# EAGLE schematic mainboard (EAGLE 9.6.2)
c't-Bot Hauptplatine v2; CC BY-SA 4.0, Timo Sandmann

## Sheet 1 of 2
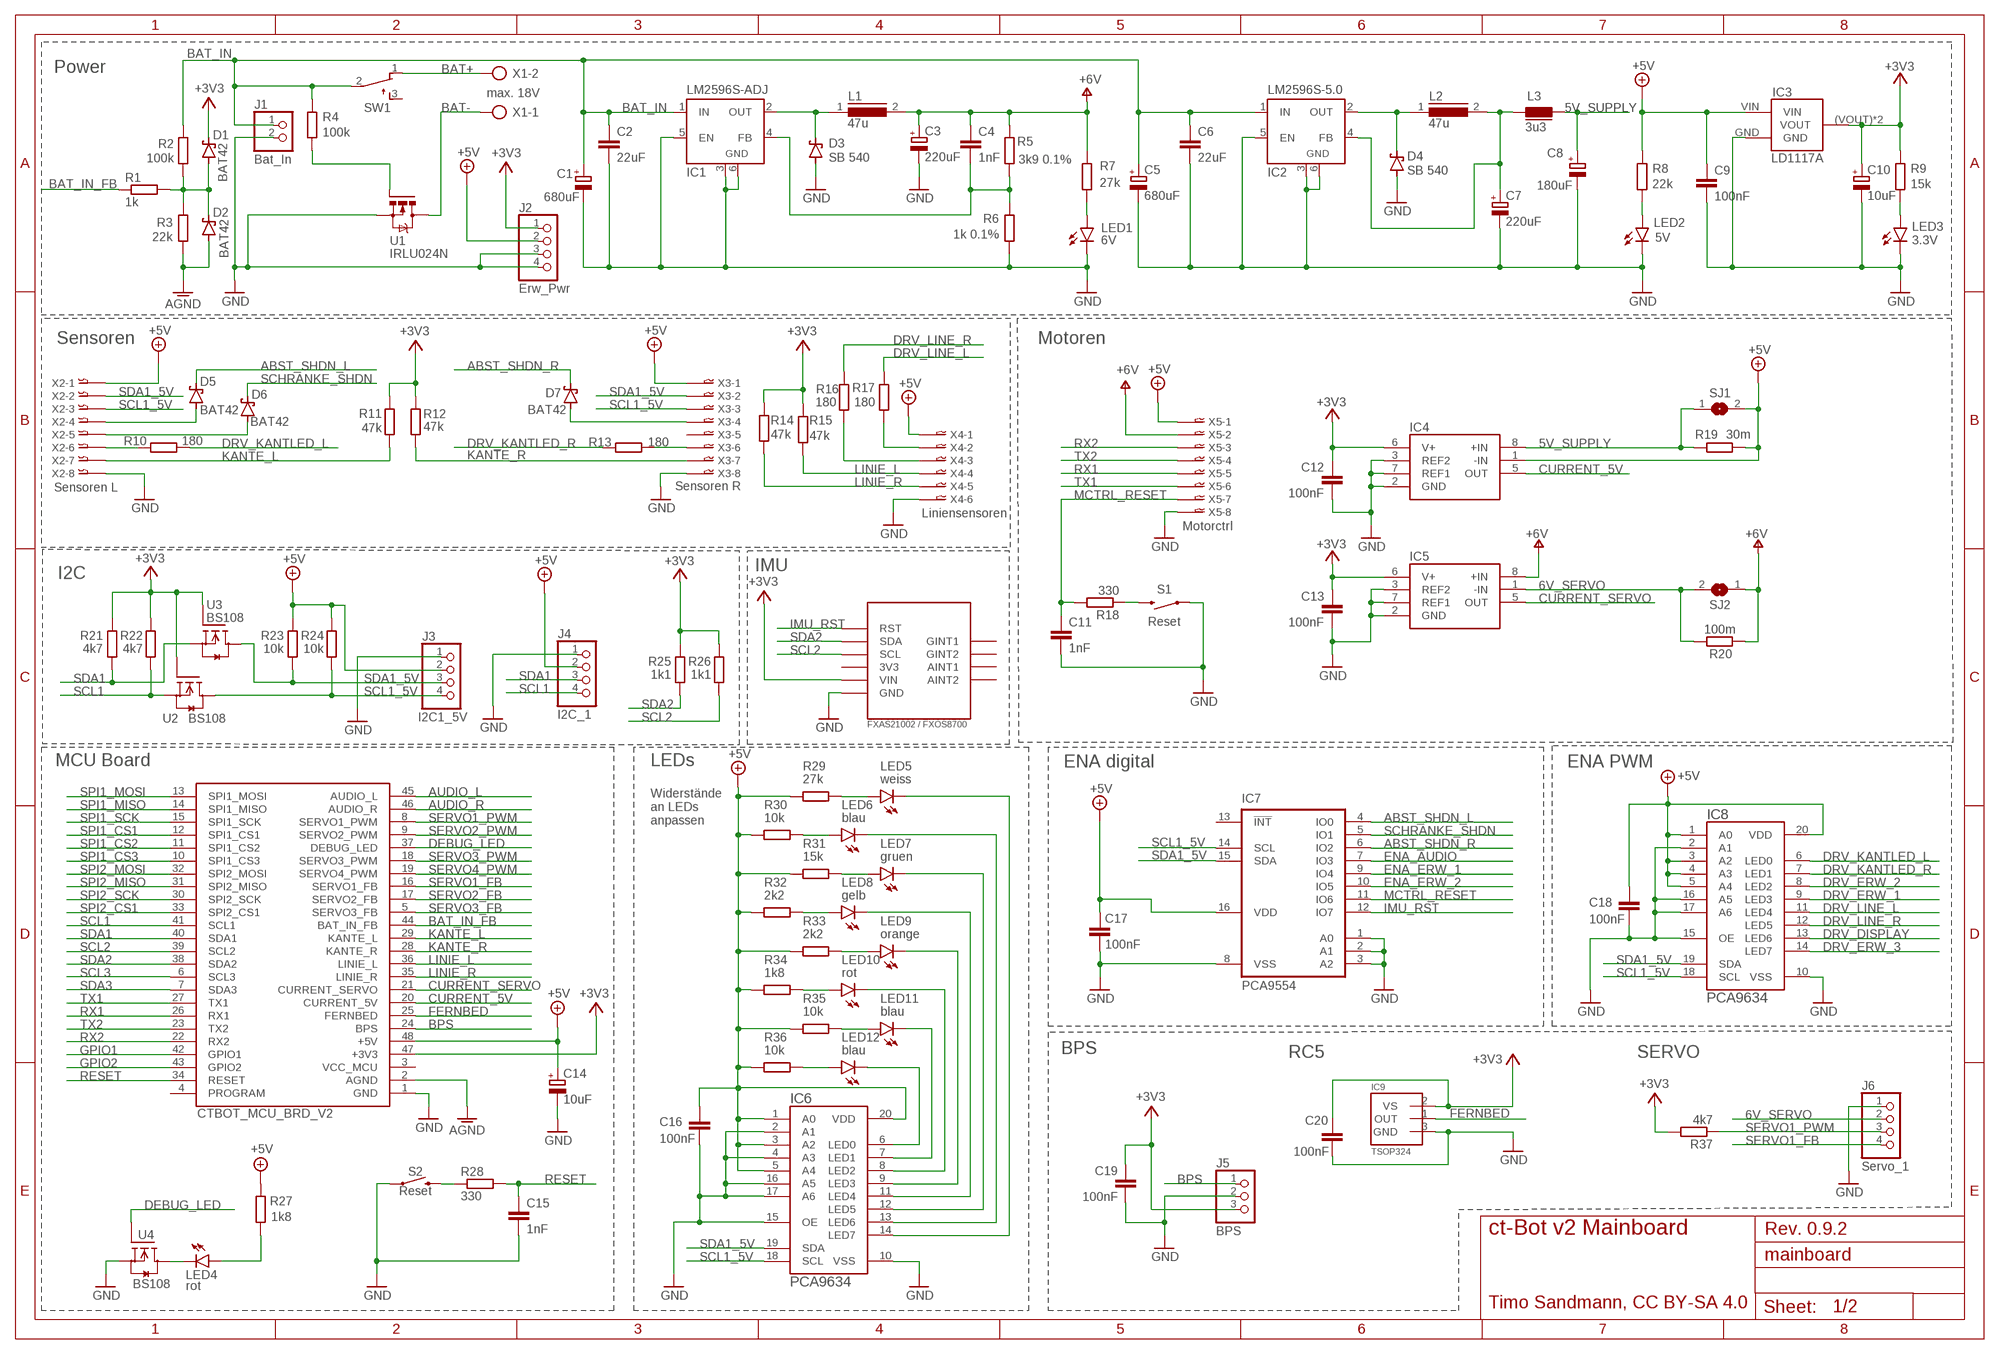
[diagram p0: schematic, sheet 1]

### Parts
C1  680uF  CPOL-EUE5-10.5  [E5-10,5]
C2  22uF  C-EU025-025X050  [C025-025X050]
C3  220uF  CPOL-EUE5-10.5  [E5-10,5]
C4  1nF  C-EU025-025X050  [C025-025X050]
C5  680uF  CPOL-EUE5-10.5  [E5-10,5]
C6  22uF  C-EU025-025X050  [C025-025X050]
C7  220uF  CPOL-EUE5-10.5  [E5-10,5]
C8  180uF  CPOL-EUE3.5-8  [E3,5-8]
C9  100nF  C-EU025-025X050  [C025-025X050]
C10  10uF  CPOL-EUE2-5  [E2-5]
C11  1nF  C-EU025-025X050  [C025-025X050]
C12  100nF  C-EUC0805  [C0805]
C13  100nF  C-EUC0805  [C0805]
C14  10uF  CPOL-EUTT2D5L  [TT2D5L]
C15  1nF  C-EU025-025X050  [C025-025X050]
C16  100nF  C-EU025-025X050  [C025-025X050]
C17  100nF  C-EU025-025X050  [C025-025X050]
C18  100nF  C-EU025-025X050  [C025-025X050]
C19  100nF  C-EU025-025X050  [C025-025X050]
C20  100nF  C-EU025-025X050  [C025-025X050]
D1  BAT42  BAT42DO35-7  [DO35-7]
D2  BAT42  BAT42DO35-7  [DO35-7]
D3  SB 540  SCHOTTKY-DIODEDO201T15  [DO201T15]
D4  SB 540  SCHOTTKY-DIODEDO201T15  [DO201T15]
D5  BAT42  BAT42"  [0207/2V]
D6  BAT42  BAT42"  [0207/2V]
D7  BAT42  BAT42"  [0207/2V]
IC1  LM2596S-ADJ  LM2596S  [TO263-5]
IC2  LM2596S-5.0  LM2596S  [TO263-5]
IC3  LD1117A  LD1117  [LD1117SOT-223]
IC4  INA28AID  [SO08]
IC5  INA28AID  [SO08]
IC6  PCA9634  PCA9634-SO20  [SO20W]
IC7  PCA9554  PCA9554D  [SO16W]
IC8  PCA9634  PCA9634-SO20  [SO20W]
IC9  TSOP324  [TSOP324]
J1  Bat_In  PINHD-1X2  [1X02]
J2  Erw_Pwr  PINHD-1X4  [1X04]
J3  I2C1_5V  PINHD-1X4  [1X04]
J4  I2C_1  PINHD-1X4  [1X04]
J5  BPS  PINHD-1X3  [1X03]
J6  Servo_1  PINHD-1X4  [1X04]
L1  47u  INDUCTOR_09HCP  [09HCP]
L2  47u  INDUCTOR_09HCP  [09HCP]
L3  3u3  07HCP-3U3  [FASTRON_07HCP_INDUCTOR]
LED1  6V  LED3MM  [LED3MM]
LED2  5V  LED3MM  [LED3MM]
LED3  3.3V  LED3MM  [LED3MM]
LED4  rot  LED3MM  [LED3MM]
LED5  weiss  LED3MM  [LED3MM]
LED6  blau  LED3MM  [LED3MM]
LED7  gruen  LED3MM  [LED3MM]
LED8  gelb  LED3MM  [LED3MM]
LED9  orange  LED3MM  [LED3MM]
LED10  rot  LED3MM  [LED3MM]
LED11  blau  LED3MM  [LED3MM]
LED12  blau  LED3MM  [LED3MM]
MCU  CTBOT_MCU_BRD_V2  [DIP48]
R1  1k  R-EU_0204/7  [0204/7]
R2  100k  R-EU_0204/7  [0204/7]
R3  22k  R-EU_0204/7  [0204/7]
R4  100k  R-EU_0204/2V  [0204V]
R5  3k9 0.1%  R-EU_0204/2V  [0204V]
R6  1k 0.1%  R-EU_0204/2V  [0204V]
R7  27k  R-EU_0204/2V  [0204V]
R8  22k  R-EU_0204/2V  [0204V]
R9  15k  R-EU_0204/2V  [0204V]
R10  180  R-EU_0204/2V  [0204V]
R11  47k  R-EU_0204/2V  [0204V]
R12  47k  R-EU_0204/2V  [0204V]
R13  180  R-EU_0204/2V  [0204V]
R14  47k  R-EU_0204/7  [0204/7]
R15  47k  R-EU_0204/7  [0204/7]
R16  180  R-EU_0204/2V  [0204V]
R17  180  R-EU_0204/2V  [0204V]
R18  330  R-EU_0204/2V  [0204V]
R19  30m  R-EU_R2512  [R2512]
R20  100m  R-EU_R2512  [R2512]
R21  4k7  R-EU_0204/7  [0204/7]
R22  4k7  R-EU_0204/7  [0204/7]
R23  10k  R-EU_0204/2V  [0204V]
R24  10k  R-EU_0204/2V  [0204V]
R25  1k1  R-EU_0204/7  [0204/7]
R26  1k1  R-EU_0204/7  [0204/7]
R27  1k8  R-EU_0204/2V  [0204V]
R28  330  R-EU_0204/2V  [0204V]
R29  27k  R-EU_0204/2V  [0204V]
R30  10k  R-EU_0204/2V  [0204V]
R31  15k  R-EU_0204/2V  [0204V]
R32  2k2  R-EU_0204/2V  [0204V]
R33  2k2  R-EU_0204/2V  [0204V]
R34  1k8  R-EU_0204/2V  [0204V]
R35  10k  R-EU_0204/2V  [0204V]
R36  10k  R-EU_0204/2V  [0204V]
R37  4k7  R-EU_0204/7  [0204/7]
S1  Reset  MOMENTARY-SWITCH-SPST-PTH-6.0MM  [TACTILE_SWITCH_PTH_6.0MM]
S2  Reset  MOMENTARY-SWITCH-SPST-PTH-6.0MM  [TACTILE_SWITCH_PTH_6.0MM]
SJ1  SJ  [SJ]
SJ2  SJ  [SJ]
SW1  TL32PO  [TL3XPO]
U1  IRLU024N  IRLU024NTO-251AA  [TO251AA]
U2  BS108  [SOT54E]
U3  BS108  [SOT54E]
U4  BS108  [SOT54E]
U$10  IMU  NXP_9DOF  [NXP_9DOF]
X1  max. 18V  SCHRAUBKLEMME/2  [AK500/2-H]
X2  Sensoren L  08-JST  [B8B-XH]
X3  Sensoren R  08-JST  [B8B-XH]
X4  Liniensensoren  06-JST-B6B-XH-A  [B6B-XH]
X5  Motorctrl  08-JST  [B8B-XH]

### Nets
5V_SUPPLY: C8.+ IC4.8(+IN) L3.2 R19.1 SJ1.1
6V_SERVO [high_current]: IC5.1(-IN) J6.2 R20.2 SJ2.2 ; also sheet 2
+3V3 [power]: C10.+ C12.1 C13.1 C19.1 C20.1 D1.C IC3.(VOUT)(VOUT) IC3.VOUT IC4.6(V+) IC5.6(V+) IC9.2(VS) J2.1 J5.3 MCU.47(+3V3) R9.2 R11.2 R12.1 R14.2 R15.2 R21.2 R22.2 R25.2 R26.2 R37.2 U2.G U3.G U$10.VIN ; also sheet 2
+5V [power]: C9.1 C14.+ C16.1 C17.1 C18.1 IC3.VIN IC4.1(-IN) IC6.1(A0) IC6.3(A2) IC6.5(A4) IC6.20(VDD) IC7.16(VDD) IC8.1(A0) IC8.3(A2) IC8.4(A3) IC8.5(A4) IC8.20(VDD) J2.2 J3.2 J4.2 MCU.48(+5V) R8.2 R19.2 R23.2 R24.2 R27.2 R29.1 R30.1 R31.1 R32.1 R33.1 R34.1 R35.1 R36.1 SJ1.2 X2.P$1 X3.P$1 X4.P$1 X5.P$1 ; also sheet 2
+6V [high_current]: C3.+ C4.1 IC5.8(+IN) L1.2 R5.2 R7.1 R20.1 SJ2.1 X5.P$2
ABST_SHDN_L: D5.2(C) IC7.4(IO0)
ABST_SHDN_R: D7.2(C) IC7.6(IO2)
AGND [power]: D2.A MCU.2(AGND) R3.1 ; also sheet 2
AUDIO_L: MCU.45(AUDIO_L) ; also sheet 2
AUDIO_R: MCU.46(AUDIO_R) ; also sheet 2
BAT+ [high_current]: SW1.1(O) X1.2
BAT- [high_current]: U1.2(D) U1.4(D) X1.1
BAT_IN [high_current]: C1.+ C2.1 C5.+ C6.1 IC1.1(IN) IC2.1(IN) J1.1 R2.2 R4.2 SW1.2(P) ; also sheet 2
BAT_IN_FB: MCU.44(BAT_IN_FB) R1.1
BPS: J5.1 MCU.24(BPS)
CURRENT_5V: IC4.5(OUT) MCU.20(CURRENT_5V)
CURRENT_SERVO: IC5.5(OUT) MCU.21(CURRENT_SERVO)
DEBUG_LED: MCU.37(DEBUG_LED) U4.G
DRV_DISPLAY: IC8.13(LED6) ; also sheet 2
DRV_ERW_1: IC8.9(LED3) ; also sheet 2
DRV_ERW_2: IC8.8(LED2) ; also sheet 2
DRV_ERW_3: IC8.14(LED7) ; also sheet 2
DRV_KANTLED_L: IC8.6(LED0) R10.2
DRV_KANTLED_R: IC8.7(LED1) R13.1
DRV_LINE_L: IC8.11(LED4) R17.2
DRV_LINE_R: IC8.12(LED5) R16.2
ENA_AUDIO: IC7.7(IO3) ; also sheet 2
ENA_ERW_1: IC7.9(IO4) ; also sheet 2
ENA_ERW_2: IC7.10(IO5) ; also sheet 2
FERNBED: IC9.1(OUT) MCU.25(FERNBED)
GND [power]: C1.- C2.2 C3.- C5.- C6.2 C7.- C8.- C9.2 C10.- C11.2 C12.2 C13.2 C14.- C15.2 C16.2 C17.2 C18.2 C19.2 C20.2 D3.A D4.A IC1.3(GND) IC1.5(EN) IC1.6(GND) IC2.3(GND) IC2.5(EN) IC2.6(GND) IC3.GND IC4.2(GND) IC4.3(REF2) IC4.7(REF1) IC5.2(GND) IC5.3(REF2) IC5.7(REF1) IC6.2(A1) IC6.4(A3) IC6.10(VSS) IC6.15(OE) IC6.16(A5) IC6.17(A6) IC7.1(A0) IC7.2(A1) IC7.3(A2) IC7.8(VSS) IC8.2(A1) IC8.10(VSS) IC8.15(OE) IC8.16(A5) IC8.17(A6) IC9.3(GND) J1.2 J2.3 J2.4 J3.1 J4.1 J5.2 J6.1 LED1.K(C) LED2.K(C) LED3.K(C) MCU.1(GND) R6.1 S1.1 S2.1 U1.3(S) U4.S U$10.GND X2.P$8 X3.P$8 X4.P$6 X5.P$8 ; also sheet 2
GPIO1: MCU.42(GPIO1) ; also sheet 2
GPIO2: MCU.43(GPIO2) ; also sheet 2
IMU_RST: IC7.12(IO7) U$10.RST ; also sheet 2
KANTE_L: MCU.29(KANTE_L) R11.1 X2.P$7
KANTE_R: MCU.28(KANTE_R) R12.2 X3.P$7
LINIE_L: MCU.36(LINIE_L) R15.1 X4.P$4
LINIE_R: MCU.35(LINIE_R) R14.1 X4.P$5
MCTRL_RESET: C11.1 IC7.11(IO6) R18.2 X5.P$7
N$1: R16.1 X4.P$3
N$2: LED3.A R9.1
N$4: D1.A D2.C R1.2 R2.1 R3.2
N$5: R18.1 S1.3
N$6: IC6.6(LED0) LED12.K(C)
N$7: IC6.7(LED1) LED11.K(C)
N$8 [power]: LED1.A R7.2
N$9: C4.2 IC1.4(FB) R5.1 R6.2
N$11: LED2.A R8.1
N$13: IC6.8(LED2) LED10.K(C)
N$14: R28.1 S2.3
N$15: IC6.9(LED3) LED9.K(C)
N$16: IC6.11(LED4) LED8.K(C)
N$17: IC6.12(LED5) LED7.K(C)
N$18: IC6.13(LED6) LED6.K(C)
N$19: IC6.14(LED7) LED5.K(C)
N$20: LED5.A R29.2
N$21: LED6.A R30.2
N$22: LED7.A R31.2
N$23: LED8.A R32.2
N$24: LED9.A R33.2
N$25: LED10.A R34.2
N$26: LED11.A R35.2
N$27: LED12.A R36.2
N$28: LED4.A R27.1
N$29: LED4.K(C) U4.D
N$30: R17.1 X4.P$2
N$38: R4.1 U1.1(G)
N$51: R10.1 X2.P$6
N$53: R13.2 X3.P$6
RESET: C15.1 MCU.34(RESET) R28.2
RX1: MCU.26(RX1) X5.P$5 ; also sheet 2
RX2: MCU.22(RX2) X5.P$3
SCHRANKE_SHDN: D6.2(C) IC7.5(IO1)
SCL1: J4.4 MCU.41(SCL1) R22.1 U2.S
SCL1_5V: IC6.18(SCL) IC7.14(SCL) IC8.18(SCL) J3.4 R24.1 U2.D X2.P$3 X3.P$3
SCL2: MCU.39(SCL2) R26.1 U$10.SCL ; also sheet 2
SCL3: MCU.6(SCL3) ; also sheet 2
SDA1: J4.3 MCU.40(SDA1) R21.1 U3.S
SDA1_5V: IC6.19(SDA) IC7.15(SDA) IC8.19(SDA) J3.3 R23.1 U3.D X2.P$2 X3.P$2
SDA2: MCU.38(SDA2) R25.1 U$10.SDA ; also sheet 2
SDA3: MCU.7(SDA3) ; also sheet 2
SERVO1_FB: J6.4 MCU.16(SERVO1_FB)
SERVO1_PWM: J6.3 MCU.8(SERVO1_PWM) R37.1
SERVO2_FB: MCU.17(SERVO2_FB) ; also sheet 2
SERVO2_PWM: MCU.9(SERVO2_PWM) ; also sheet 2
SERVO3_FB: MCU.5(SERVO3_FB) ; also sheet 2
SERVO3_PWM: MCU.18(SERVO3_PWM) ; also sheet 2
SERVO4_PWM: MCU.19(SERVO4_PWM) ; also sheet 2
SPI1_CS1: MCU.12(SPI1_CS1) ; also sheet 2
SPI1_CS2: MCU.11(SPI1_CS2) ; also sheet 2
SPI1_CS3: MCU.10(SPI1_CS3) ; also sheet 2
SPI1_MISO: MCU.14(SPI1_MISO) ; also sheet 2
SPI1_MOSI: MCU.13(SPI1_MOSI) ; also sheet 2
SPI1_SCK: MCU.15(SPI1_SCK) ; also sheet 2
SPI2_CS1: MCU.33(SPI2_CS1) ; also sheet 2
SPI2_MISO: MCU.31(SPI2_MISO) ; also sheet 2
SPI2_MOSI: MCU.32(SPI2_MOSI) ; also sheet 2
SPI2_SCK: MCU.30(SPI2_SCK) ; also sheet 2
TX1: MCU.27(TX1) X5.P$6 ; also sheet 2
TX2: MCU.23(TX2) X5.P$4
V5_L2 [high_current]: D4.C IC2.2(OUT) L2.1
V5_L3 [power]: C7.+ IC2.4(FB) L2.2 L3.1
V6_L1 [high_current]: D3.C IC1.2(OUT) L1.1
VL53L0X_SHUT_L: D5.1(A) X2.P$4
VL53L0X_SHUT_R: D7.1(A) X3.P$4
VL6180X_SHDN: D6.1(A) X2.P$5
Unconnected: IC7.13(!INT) MCU.4(PROGRAM) SW1.3(S) U$10.3V3 U$10.AINT1 U$10.AINT2 U$10.GINT1 U$10.GINT2 X3.P$5

### Notes on the sheet
- Power
- Sensoren | Motoren
- IMU
- I2C
- MCU Board | LEDs | ENA digital | ENA PWM
- Widerstände
  an LEDs
  anpassen
- BPS | RC5 | SERVO
- Rev. 0.9.2
- ct-Bot v2 Mainboard
- Timo Sandmann, CC BY-SA 4.0

## Sheet 2 of 2
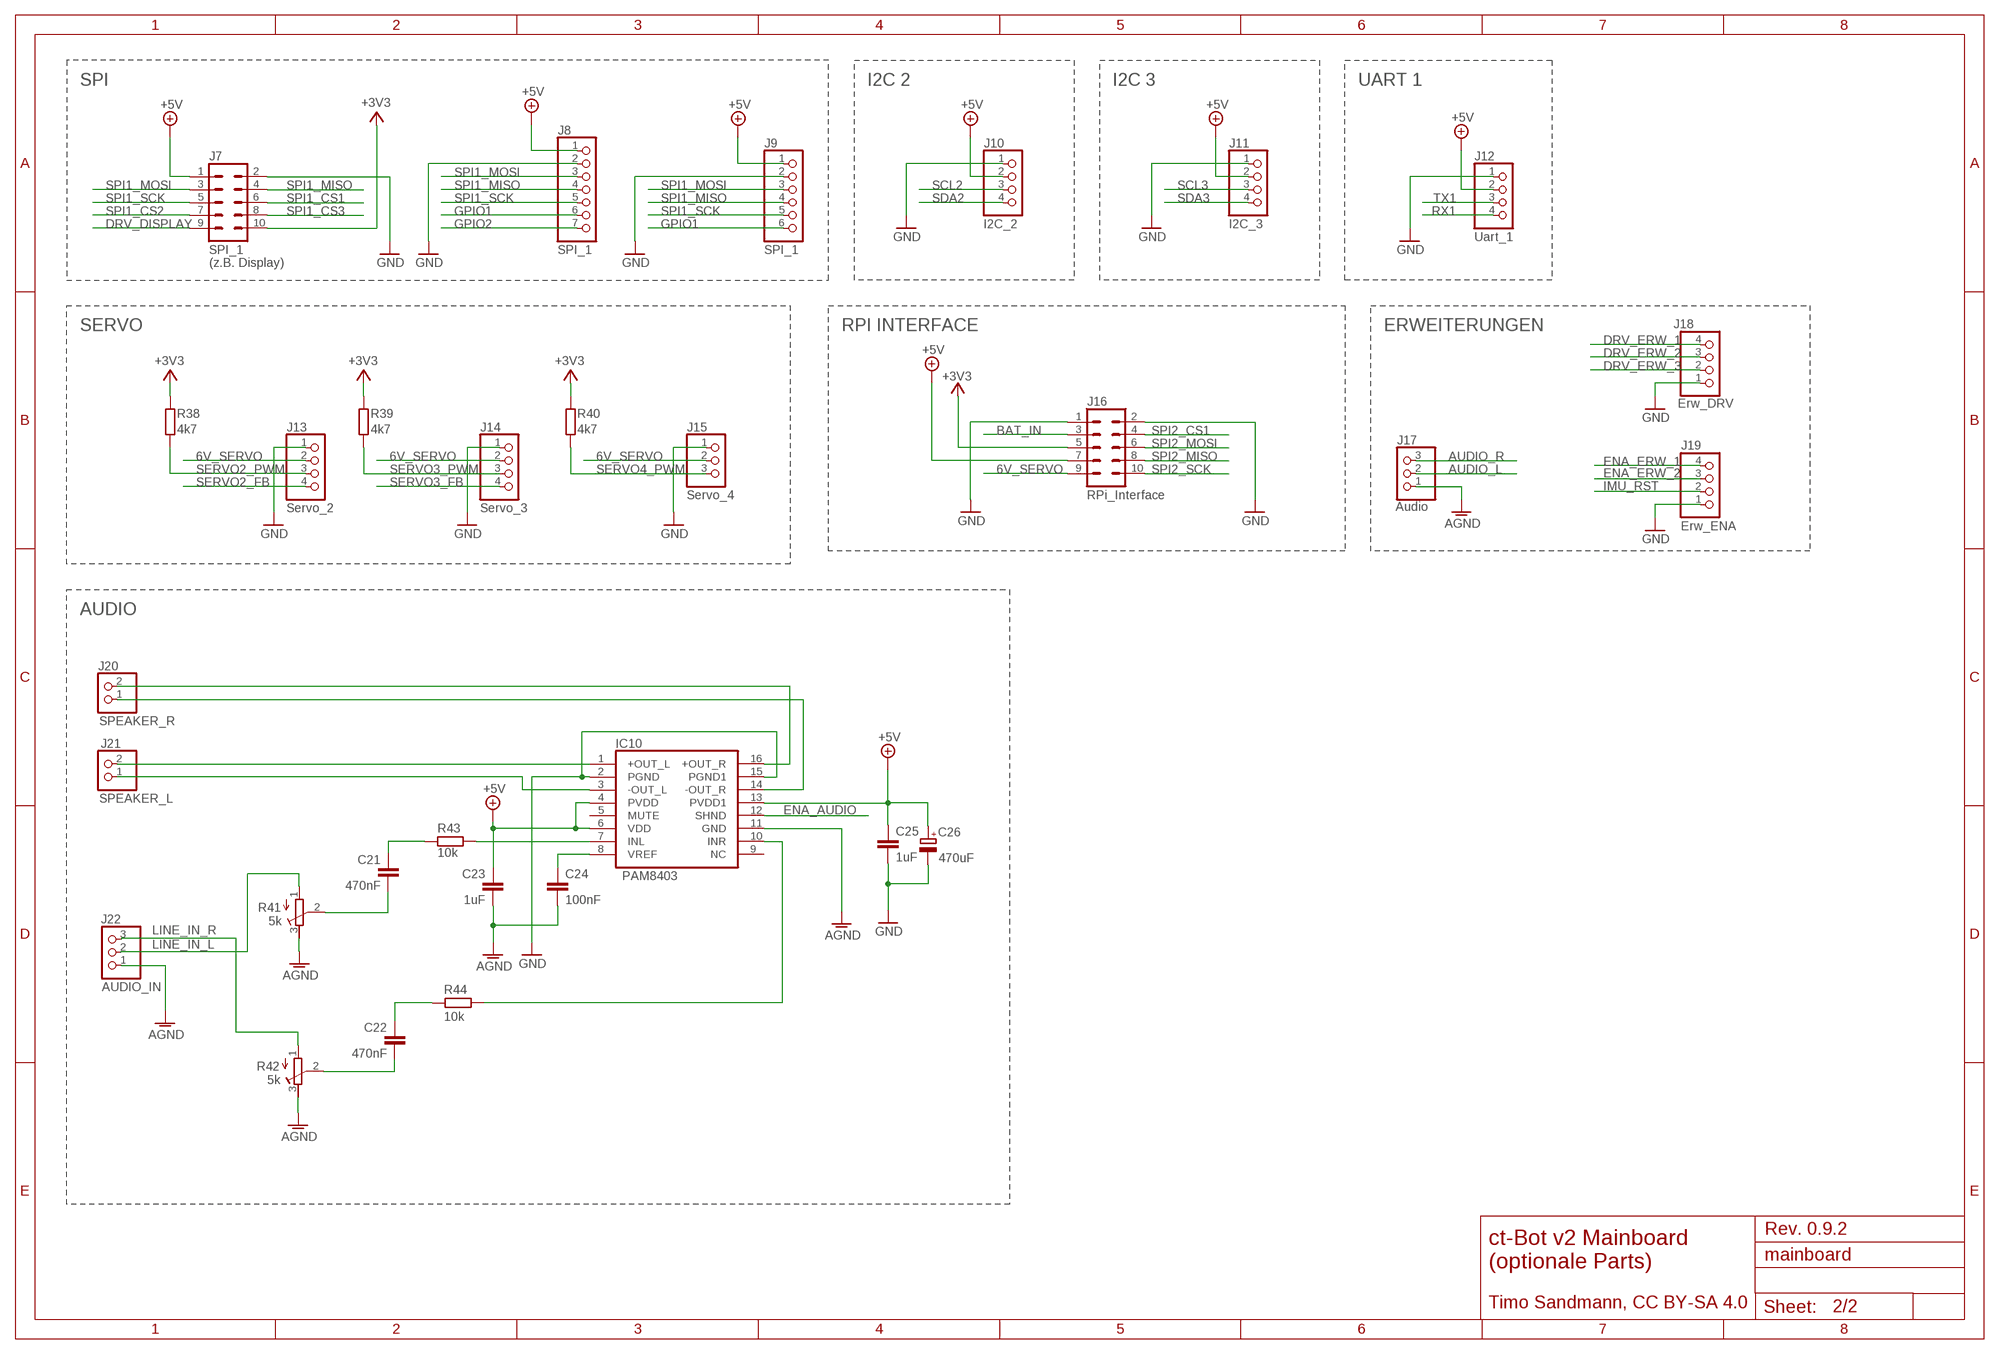
[diagram p1: schematic, sheet 2]

### Parts
C21  470nF  C-EU025-025X050  [C025-025X050]
C22  470nF  C-EU025-025X050  [C025-025X050]
C23  1uF  C-EU025-025X050  [C025-025X050]
C24  100nF  C-EU025-025X050  [C025-025X050]
C25  1uF  C-EU025-025X050  [C025-025X050]
C26  470uF  CPOL-EUE3.5-8  [E3,5-8]
IC10  PAM8403  [SOP-16]
J7  SPI_1  ML10  [ML10]
J8  SPI_1  PINHD-1X7  [1X07]
J9  SPI_1  PINHD-1X6  [1X06]
J10  I2C_2  PINHD-1X4  [1X04]
J11  I2C_3  PINHD-1X4  [1X04]
J12  Uart_1  PINHD-1X4  [1X04]
J13  Servo_2  PINHD-1X4  [1X04]
J14  Servo_3  PINHD-1X4  [1X04]
J15  Servo_4  PINHD-1X3  [1X03]
J16  RPi_Interface  ML10  [ML10]
J17  Audio  PINHD-1X3  [1X03]
J18  Erw_DRV  PINHD-1X4  [1X04]
J19  Erw_ENA  PINHD-1X4  [1X04]
J20  SPEAKER_R  PINHD-1X2  [1X02]
J21  SPEAKER_L  PINHD-1X2  [1X02]
J22  AUDIO_IN  PINHD-1X3  [1X03]
R38  4k7  R-EU_0204/7  [0204/7]
R39  4k7  R-EU_0204/7  [0204/7]
R40  4k7  R-EU_0204/7  [0204/7]
R41  5k  R-TRIMM64W  [RTRIM64W]
R42  5k  R-TRIMM64W  [RTRIM64W]
R43  10k  R-EU_0204/2V  [0204V]
R44  10k  R-EU_0204/2V  [0204V]

### Nets
6V_SERVO [high_current]: J13.2 J14.2 J15.2 J16.9 ; also sheet 1
+3V3 [power]: J7.10 J16.5 R38.2 R39.2 R40.2 ; also sheet 1
+5V [power]: C23.1 C25.1 C26.+ IC10.4(PVDD) IC10.6(VDD) IC10.13(PVDD1) J7.1 J8.1 J9.1 J10.2 J11.2 J12.2 J16.7 ; also sheet 1
AGND [power]: C23.2 C24.2 IC10.11(GND) J17.1 J22.1 R41.3(E) R42.3(E) ; also sheet 1
AUDIO_L: J17.2 ; also sheet 1
AUDIO_R: J17.3 ; also sheet 1
BAT_IN [high_current]: J16.3 ; also sheet 1
DRV_DISPLAY: J7.9 ; also sheet 1
DRV_ERW_1: J18.4 ; also sheet 1
DRV_ERW_2: J18.3 ; also sheet 1
DRV_ERW_3: J18.2 ; also sheet 1
ENA_AUDIO: IC10.12(SHND) ; also sheet 1
ENA_ERW_1: J19.4 ; also sheet 1
ENA_ERW_2: J19.3 ; also sheet 1
GND [power]: C25.2 C26.- IC10.2(PGND) IC10.15(PGND1) J7.2 J8.2 J9.2 J10.1 J11.1 J12.1 J13.1 J14.1 J15.1 J16.1 J16.2 J18.1 J19.1 ; also sheet 1
GPIO1: J8.6 J9.6 ; also sheet 1
GPIO2: J8.7 ; also sheet 1
IMU_RST: J19.2 ; also sheet 1
LINE_IN_L: J22.2 R41.1(A)
LINE_IN_R: J22.3 R42.1(A)
N$31: IC10.1(+OUT_L) J21.2
N$32: IC10.3(-OUT_L) J21.1
N$33: C24.1 IC10.8(VREF)
N$39: C22.2 R42.2(S)
N$40: IC10.7(INL) R43.1
N$41: C21.1 R43.2
N$42: C21.2 R41.2(S)
N$43: IC10.14(-OUT_R) J20.1
N$44: IC10.16(+OUT_R) J20.2
N$46: IC10.10(INR) R44.1
N$48: C22.1 R44.2
RX1: J12.4 ; also sheet 1
SCL2: J10.3 ; also sheet 1
SCL3: J11.3 ; also sheet 1
SDA2: J10.4 ; also sheet 1
SDA3: J11.4 ; also sheet 1
SERVO2_FB: J13.4 ; also sheet 1
SERVO2_PWM: J13.3 R38.1 ; also sheet 1
SERVO3_FB: J14.4 ; also sheet 1
SERVO3_PWM: J14.3 R39.1 ; also sheet 1
SERVO4_PWM: J15.3 R40.1 ; also sheet 1
SPI1_CS1: J7.6 ; also sheet 1
SPI1_CS2: J7.7 ; also sheet 1
SPI1_CS3: J7.8 ; also sheet 1
SPI1_MISO: J7.4 J8.4 J9.4 ; also sheet 1
SPI1_MOSI: J7.3 J8.3 J9.3 ; also sheet 1
SPI1_SCK: J7.5 J8.5 J9.5 ; also sheet 1
SPI2_CS1: J16.4 ; also sheet 1
SPI2_MISO: J16.8 ; also sheet 1
SPI2_MOSI: J16.6 ; also sheet 1
SPI2_SCK: J16.10 ; also sheet 1
TX1: J12.3 ; also sheet 1
Unconnected: IC10.5(MUTE) IC10.9(NC)

### Notes on the sheet
- SPI | I2C 2 | I2C 3 | UART 1
- (z.B. Display)
- SERVO | RPI INTERFACE | ERWEITERUNGEN
- AUDIO
- Rev. 0.9.2
- ct-Bot v2 Mainboard
  (optionale Parts)
- Timo Sandmann, CC BY-SA 4.0

## Power pins joined to a net without a drawn wire
VCC_MCU: MCU.3(VCC_MCU)

## Library data of the parts
C1 C3 C5 C7 C8 C10 C14 C26 = rcl:CPOL-EU: POLARIZED CAPACITOR, European symbol; SPICEPREFIX: C
C2 C4 C6 C9 C11-C13 C15-C25 = rcl:C-EU: CAPACITOR, European symbol; SPICEPREFIX: C
D1 D2 D5-D7 = ct-bot:BAT42: DIODE barrier diode
D3 D4 = diode:SCHOTTKY-DIODE: Schottky Diode
IC1 IC2 = ct-bot:LM2596S: STEP-DOWN VOLTAGE REGULATOR
IC3 = ct-bot:LD1117
IC4 IC5 = ct-bot:INA28*: High-Accuracy, Wide Common-Mode Range, Bidirectional Current Shunt Monitors, Zero-Drift Series; MF: TEXAS INSTRUMENTS
IC6 IC8 = ct-bot:PCA9634: NXP PCA9634 8-bit LED Controller
IC7 = ct-bot:PCA9554: I/O EXPANDER 8-bit I2C-bus and SMBus I/O port with interrupt
IC9 = ct-bot:TSOP324*: IR Receiver Modules for Remote Control Systems http://www.vishay.com/ir-receiver-modules/
IC10 = ct-bot:PAM8403: Dual channel audio amplifier IC - PAM8403
J1 J20 J21 = ct-bot:PINHD-1X2: PIN HEADER
J2-J4 J6 J10-J14 J18 J19 = ct-bot:PINHD-1X4: PIN HEADER
J5 J15 J17 J22 = ct-bot:PINHD-1X3: PIN HEADER
J7 J16 = con-harting-ml:ML10: HARTING; OC_FARNELL: unknown; OC_NEWARK: unknown
J8 = ct-bot:PINHD-1X7: PIN HEADER
J9 = ct-bot:PINHD-1X6: PIN HEADER
L1 L2 = ct-bot:INDUCTOR_09HCP: INDUCTOR
L3 = ct-bot:07HCP-*: Fastron 07 HCP Series Inductors (Ferrite Core) (1 … 10000)uH, THT vertical assembly, 5 mm grid / 8.3 mm max. diameter / 10 mm max. height RoHS-Compliant Source: www.fastrongroup.co Technologies: 07HCP-… L/uH RDCmax/Ω IN/A Isat/A 1R0 1 0.06 7.5 10 2R2 2.2 0.01 6 8 3R3 3.3 0.013 5 6.3 4R7 4.7 0.018 4 5.4 6R8 6.8 0.025 3.8 6.5 100 10 0.04 2.6 5 220 22 0.055 2.3 3.6 470 47 0.1 1.3 2.5 680 68 0.14 1.1 2.1 820 82 0.16 1 1.9 101 100 0.19 0.9 1.6 121 120 0.22 0.85 1 221 220 0.38 0.64 1.2 331 330 0.7 0.51 0.85 471 470 0.89 0.43 0.8 821 820 1.56 0.36 0.7 102 1000 1.84 0.3 0.5 182 1800 3.3 0.21 0.35 103 10000 24 0.14 0.17 ±10% / ±20% fL = 1 kHz | 0.25 V Author: Dipl.-Ing. FH Rainer Bayer HHN Hochschule Heilbronn, rainer.bayer@hs-heilbronn.de Ingenieurbüro ing-rb, mail@ing-rb.de; FASTRON#: 07HCP-3R3
LED1-LED12 = led:LED: LED OSRAM: - CHIPLED LG R971, LG N971, LY N971, LG Q971, LY Q971, LO R971, LY R971 LH N974, LH R974 LS Q976, LO Q976, LY Q976 LO Q996 - Hyper CHIPLED LW Q18S LB Q993, LB Q99A, LB R99A - SideLED LS A670, LO A670, LY A670, LG A670, LP A670 LB A673, LV A673, LT A673, LW A673 LH A674 LY A675 LS A676, LA A676, LO A676, LY A676, LW A676 LS A679, LY A679, LG A679 - Hyper Micro SIDELED® LS Y876, LA Y876, LO Y876, LY Y876 LT Y87S - SmartLED LW L88C, LW L88S LB L89C, LB L89S, LG L890 LS L89K, LO L89K, LY L89K LS L896, LA L896, LO L896, LY L896 - TOPLED LS T670, LO T670, LY T670, LG T670, LP T670 LSG T670, LSP T670, LSY T670, LOP T670, LYG T670 LG T671, LOG T671, LSG T671 LB T673, LV T673, LT T673, LW T673 LH T674 LS T676, LA T676, LO T676, LY T676, LB T676, LH T676, LSB T676, LW T676 LB T67C, LV T67C, LT T67C, LS T67K, LO T67K, LY T67K, LW E67C LS E67B, LA E67B, LO E67B, LY E67B, LB E67C, LV E67C, LT E67C LW T67C LS T679, LY T679, LG T679 LS T770, LO T770, LY T770, LG T770, LP T770 LB T773, LV T773, LT T773, LW T773 LH T774 LS E675, LA E675, LY E675, LS T675 LS T776, LA T776, LO T776, LY T776, LB T776 LHGB T686 LT T68C, LB T68C - Hyper Mini TOPLED® LB M676 - Mini TOPLED Santana® LG M470 LS M47K, LO M47K, LY M47K Source: http://www.osram.convergy.de LUXEON: - LUMILED® LXK2-PW12-R00, LXK2-PW12-S00, LXK2-PW14-U00, LXK2-PW14-V00 LXK2-PM12-R00, LXK2-PM12-S00, LXK2-PM14-U00 LXK2-PE12-Q00, LXK2-PE12-R00, LXK2-PE12-S00, LXK2-PE14-T00, LXK2-PE14-U00 LXK2-PB12-K00, LXK2-PB12-L00, LXK2-PB12-M00, LXK2-PB14-N00, LXK2-PB14-P00, LXK2-PB14-Q00 LXK2-PR12-L00, LXK2-PR12-M00, LXK2-PR14-Q00, LXK2-PR14-R00 LXK2-PD12-Q00, LXK2-PD12-R00, LXK2-PD12-S00 LXK2-PH12-R00, LXK2-PH12-S00 LXK2-PL12-P00, LXK2-PL12-Q00, LXK2-PL12-R00 Source: www.luxeon.com KINGBRIGHT: KA-3528ASYC Source: www.kingbright.com
MCU = ct-bot:CTBOT_MCU_BRD_V2
R1-R40 R43 R44 = rcl:R-EU_: RESISTOR, European symbol; SPICEPREFIX: R
R41 R42 = ct-bot:R-TRIMM: Trimm resistor; SPICEMODEL: X; SPICEPREFIXL: POT
S1 S2 = SparkFun-Switches:MOMENTARY-SWITCH-SPST: Momentary Switch (Pushbutton) - SPST Normally-open (NO) SPST momentary switches (buttons, pushbuttons). Variants PTH-12MM - 12mm square, through-hole Momentary Pushbutton Switch - 12mm Square <https://www.sparkfun.com/products/9190> (COM-09190) PTH-6.0MM, PTH-6.0MM-KIT - 6.0mm square, through-hole Mini Pushbutton Switch <https://www.sparkfun.com/products/97> (COM-00097) KIT package intended for soldering kit's - only one side of pads' copper is exposed. PTH-RIGHT-ANGLE-KIT - Right-angle, through-hole Right Angle Tactile Button <https://www.sparkfun.com/products/10791> - Used on SparkFun BigTime Watch Kit <https://www.sparkfun.com/products/11734> SMD-12MM - 12mm square, surface-mount Tactile Button - SMD (12mm) <https://www.sparkfun.com/products/12993> (COM-12993) Used on SparkFun PicoBoard <https://www.sparkfun.com/products/11888> SMD-4.5MM - 4.5mm Square Trackball Switch Used on SparkFun Blackberry Trackballer Breakout <https://www.sparkfun.com/products/13169> SMD-4.6MMX2.8MM - 4.60mm x 2.80mm, surface mount Used on SparkFun SAMD21 Mini Breakout <https://www.sparkfun.com/products/13664> SMD-5.2MM, SMD-5.2-REDUNDANT - 5.2mm square, surface-mount Mini Pushbutton Switch - SMD <https://www.sparkfun.com/products/8720> (COM-08720) Used on Arduino Pro Mini <https://www.sparkfun.com/products/11114> REDUNDANT package connects both switch circuits together SMD-6.0X3.5MM - 6.0 x 3.5mm, surface mount Momentary Reset Switch SMD <https://www.sparkfun.com/products/8229> (COM-08229) SMD-6.2MM-TALL - 6.2mm square, surface mount Tactile Button - SMD (6mm) <https://www.sparkfun.com/products/12992> Used on SparkFun Digital Sandbox <https://www.sparkfun.com/products/12651> SMD-RIGHT-ANGLE - Right-angle, surface mount Used on SparkFun Block for Intel® Edison - Arduino <https://www.sparkfun.com/products/13036>; PROD_ID: SWCH-08441; SF_SKU: COM-00097
SJ1 SJ2 = jumper:SJ: SMD solder JUMPER
SW1 = switch:TL32PO: TINY SWITCH ON - MOM Source: http://www2.produktinfo.conrad.com/datenblaetter/700000-724999/705152-da-01-de-Subminiaturschalter_TL_36YO.pdf
U1 = ct-bot:IRLU024N: N-CHANNEL MOS FET IRLU 024N
U2-U4 = ct-bot:BS108: N-CHANNEL MOS FET
U$10 = ct-bot:NXP_9DOF
X1 = ct-bot:SCHRAUBKLEMME/2; OC_FARNELL: unknown; OC_NEWARK: unknown
X2 X3 X5 = ct-bot:08-JST: JST CONNECTOR
X4 = ct-bot:06-JST: JST CONNECTOR

## Net classes
0 default: width 0.203 mm, drill 0.33 mm, clearance 0.203 mm
1 power: width 0.305 mm, drill 0.33 mm, clearance 0.203 mm to class 0, clearance 0.203 mm
2 high_current: width 0.305 mm, drill 0.33 mm, clearance 0.203 mm to class 0, clearance 0.203 mm to class 1, clearance 0.203 mm